# Altium schematic sheet xl6009_kian_v1_SWITCHING.SchDoc
size 381 x 241 mm; SheetNumber: 3; SheetTotal: 3
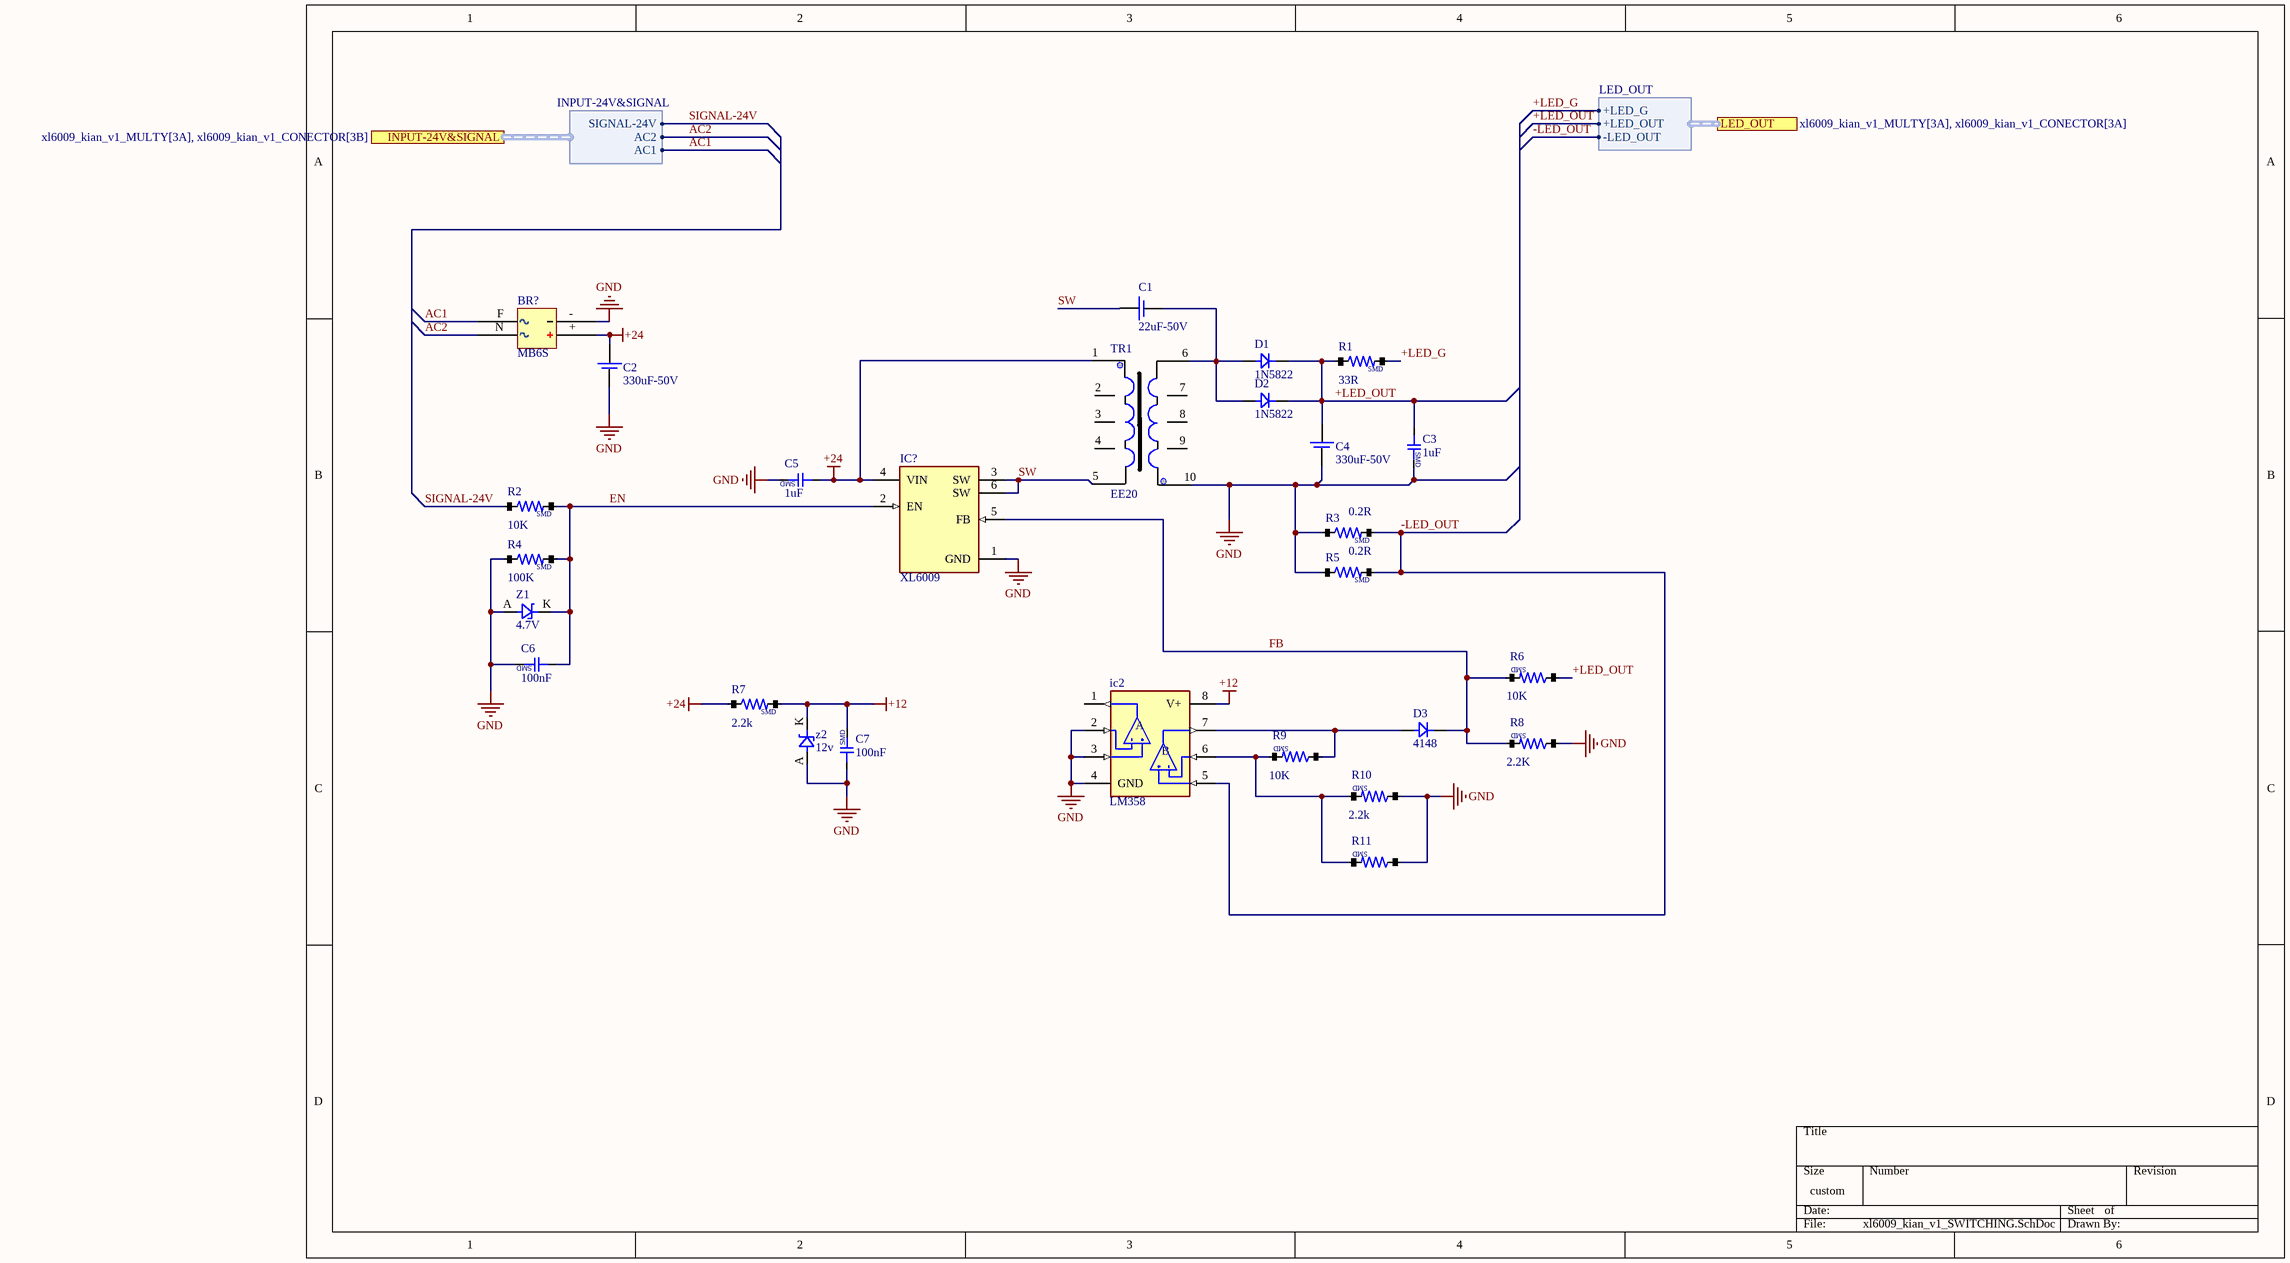
[diagram p0: xl6009_kian_v1_SWITCHING.SchDoc]

## Parts
BR?  MB6S  [MB6S/SMD]
C1  22uF-50V  [CAP-EL-P3.5MM]
C2  330uF-50V  [CAP-EL-P3.5MM]
C3  1uF  [CAP-0805]
C4  330uF-50V  [CAP-EL-P3.5MM]
C5  1uF  [CAP-0805]
C6  100nF  [CAP-0805]
C7  100nF  [CAP-0805]
D1  1N5822  [DIOD/1N4007/DIP]
D2  1N5822  [DIOD/1N4007/SMD]
D3  4148  [DIOD/1N4007/SMD]
ic2  LM358  [SOP-8]
IC?  XL6009  [TO-263-5L]
R1  33R  [RES/1206]
R2  10K  [RES/0805]
R3  0.2R  [RES/1206]
R4  100K  [RES/0805]
R5  0.2R  [RES/1206]
R6  10K  [RES/0805]
R7  2.2k  [RES/1206]
R8  2.2K  [RES/0805]
R9  10K  [RES/0805]
R10  2.2k  [RES/0805]
R11  (no value)  [RES/0805]
TR1  EE20  [EE20-]
Z1  4.7V  [DIOD/RS1J]
z2  12v  [DIOD/RS1J]

## Ports
INPUT-24V&SIGNAL (harness INPUT-24V&SIGNAL, see xl6009_kian_v1_MULTY[3A], xl6009_kian_v1_CONECTOR[3B]), LED_OUT (harness LED_OUT, see xl6009_kian_v1_MULTY[3A], xl6009_kian_v1_CONECTOR[3A])

## Harnesses
INPUT-24V&SIGNAL: AC1, AC2, SIGNAL-24V
LED_OUT: +LED_G, +LED_OUT, -LED_OUT

## Nets
+12: C7.2 ic2.8(V+) R7.2 z2.K
+24: BR?.+ C2.+ C5.1 IC?.4(VIN) R7.1 TR1.1
GND: BR?.- C2.- C3.2 C4.- C5.2 C6.2 C7.1 ic2.2(-INA) ic2.3(+INA) ic2.4(GND) IC?.1(GND) R3.1 R4.1 R5.1 R8.1 R10.1 R11.1 TR1.10 Z1.A z2.A
+LED_G: R1.2 ; port LED_OUT.+LED_G
+LED_OUT: C3.1 C4.+ D1.K D2.K R1.1 R6.1 ; port LED_OUT.+LED_OUT
-LED_OUT: ic2.5(+INB) R3.2 R5.2 ; port LED_OUT.-LED_OUT
AC1: BR?.F ; port INPUT-24V&SIGNAL.AC1
AC2: BR?.N ; port INPUT-24V&SIGNAL.AC2
EN: C6.1 IC?.2(EN) R2.2 R4.2 Z1.K
FB: D3.K IC?.5(FB) R6.2 R8.2
SIGNAL-24V: R2.1 ; port INPUT-24V&SIGNAL.SIGNAL-24V
SW: C1.+ IC?.3(SW) IC?.6(SW) TR1.5
NetC1_-: C1.- D1.A D2.A TR1.6
NetD3_A: D3.A ic2.7(OUTB) R9.1
Netic2_6: ic2.6(-INB) R9.2 R10.2 R11.2

Not connected (* = marked no-connect by the designer): ic2 1(OUTA); TR1 2(0) 3(0) 4(0) 7(0) 8(0) 9(0)

## Notes on the sheet
- (in symbol cap_smd) SMD
- (in symbol LM358) A; B
- (in symbol RES/SMD) SMD

## Library data of the parts
BR? = BRIDGE RECTIFIERS/SMD
C1 C2 C4 = cap-electrolit
C3 C5-C7 = cap_smd
D1-D3 = DIOD/RECTIFIERS
R1-R11 = RES/SMD
TR1 = TRANS_NORMAL
Z1 z2 = zener-0.5w